# EAGLE schematic daughterboard-schematic (EAGLE 7.3.0)
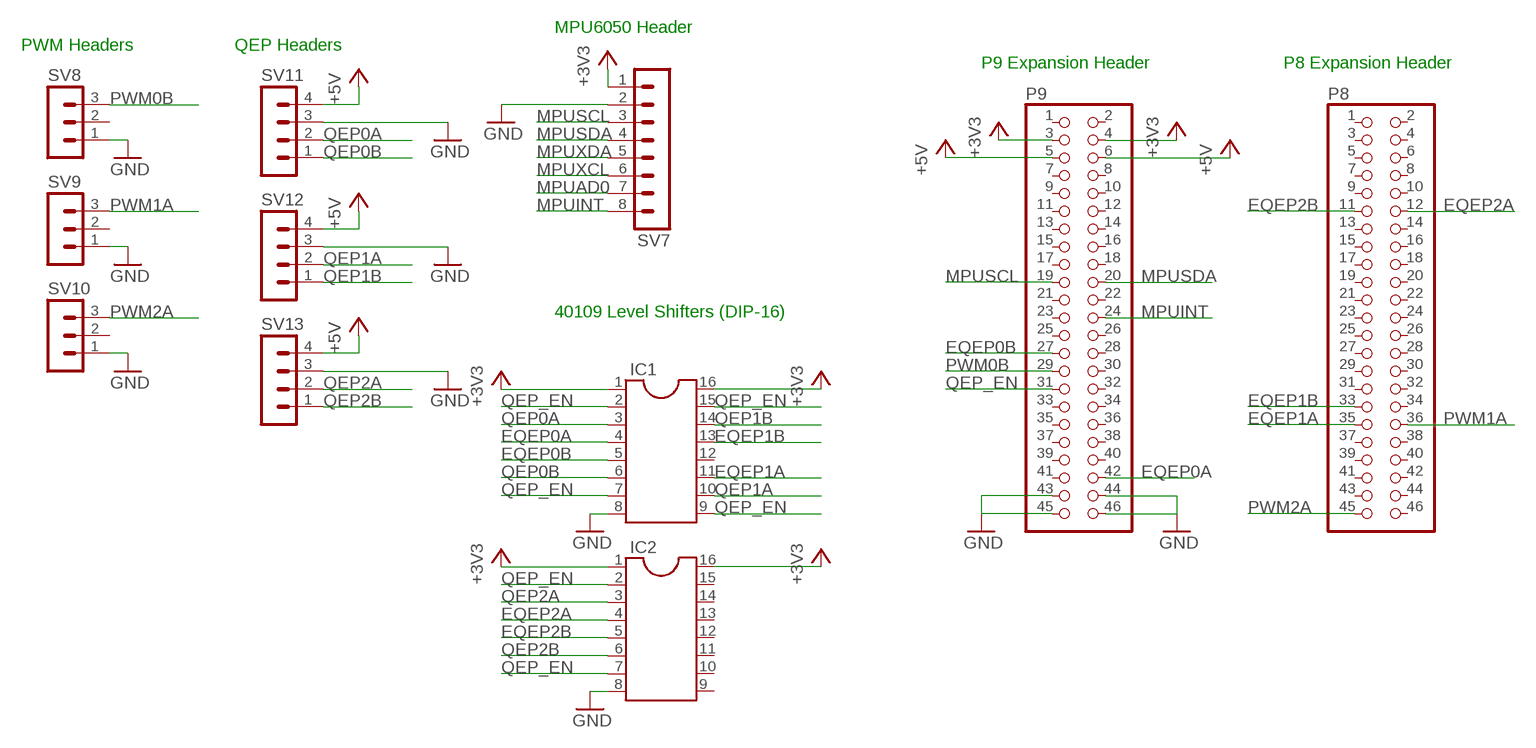
[diagram p0: schematic, sheet 1]

## Parts
IC1  DIL16  [DIL16]
IC2  DIL16  [DIL16]
P8  PINHD-2X23  [2X23]
P9  PINHD-2X23  [2X23]
SV7  MA08-1  [MA08-1]
SV8  MA03-1  [MA03-1]
SV9  MA03-1  [MA03-1]
SV10  MA03-1  [MA03-1]
SV11  MA04-1  [MA04-1]
SV12  MA04-1  [MA04-1]
SV13  MA04-1  [MA04-1]

## Nets
+3V3: IC1.1 IC1.16 IC2.1 IC2.16 P9.3 P9.4 SV7.1
+5V: P9.5 P9.6 SV11.4 SV12.4 SV13.4
EQEP0A: IC1.4 P9.42
EQEP0B: IC1.5 P9.27
EQEP1A: IC1.11 P8.35
EQEP1B: IC1.13 P8.33
EQEP2A: IC2.4 P8.12
EQEP2B: IC2.5 P8.11
GND: IC1.8 IC2.8 P9.43 P9.44 P9.45 P9.46 SV7.2 SV8.1 SV9.1 SV10.1 SV11.3 SV12.3 SV13.3
MPUAD0: SV7.7
MPUINT: P9.24 SV7.8
MPUSCL: P9.19 SV7.3
MPUSDA: P9.20 SV7.4
MPUXCL: SV7.6
MPUXDA: SV7.5
PWM0B: P9.29 SV8.3
PWM1A: P8.36 SV9.3
PWM2A: P8.45 SV10.3
QEP0A: IC1.3 SV11.2
QEP0B: IC1.6 SV11.1
QEP1A: IC1.10 SV12.2
QEP1B: IC1.14 SV12.1
QEP2A: IC2.3 SV13.2
QEP2B: IC2.6 SV13.1
QEP_EN: IC1.2 IC1.7 IC1.9 IC1.15 IC2.2 IC2.7 P9.31
Unconnected: IC1.12 IC2.9 IC2.10 IC2.11 IC2.12 IC2.13 IC2.14 IC2.15 P8.1 P8.2 P8.3 P8.4 P8.5 P8.6 P8.7 P8.8 P8.9 P8.10 P8.13 P8.14 P8.15 P8.16 P8.17 P8.18 P8.19 P8.20 P8.21 P8.22 P8.23 P8.24 P8.25 P8.26 P8.27 P8.28 P8.29 P8.30 P8.31 P8.32 P8.34 P8.37 P8.38 P8.39 P8.40 P8.41 P8.42 P8.43 P8.44 P8.46 P9.1 P9.2 P9.7 P9.8 P9.9 P9.10 P9.11 P9.12 P9.13 P9.14 P9.15 P9.16 P9.17 P9.18 P9.21 P9.22 P9.23 P9.25 P9.26 P9.28 P9.30 P9.32 P9.33 P9.34 P9.35 P9.36 P9.37 P9.38 P9.39 P9.40 P9.41 SV8.2 SV9.2 SV10.2

## Notes on the sheet
- MPU6050 Header
- PWM Headers | QEP Headers
- P9 Expansion Header | P8 Expansion Header
- 40109 Level Shifters (DIP-16)

## Library data of the parts
IC1 IC2 = ic-package:DIL16: Dual In Line / Socket
P8 P9 = pinheader-2x23:PINHD-2X23: PIN HEADER
SV7 = con-lstb:MA08-1: PIN HEADER; OC_FARNELL: unknown; OC_NEWARK: unknown
SV8-SV10 = con-lstb:MA03-1: PIN HEADER; OC_FARNELL: unknown; OC_NEWARK: unknown
SV11-SV13 = con-lstb:MA04-1: PIN HEADER; OC_FARNELL: unknown; OC_NEWARK: unknown